# EAGLE design OPLSniffer (EAGLE 6.4)
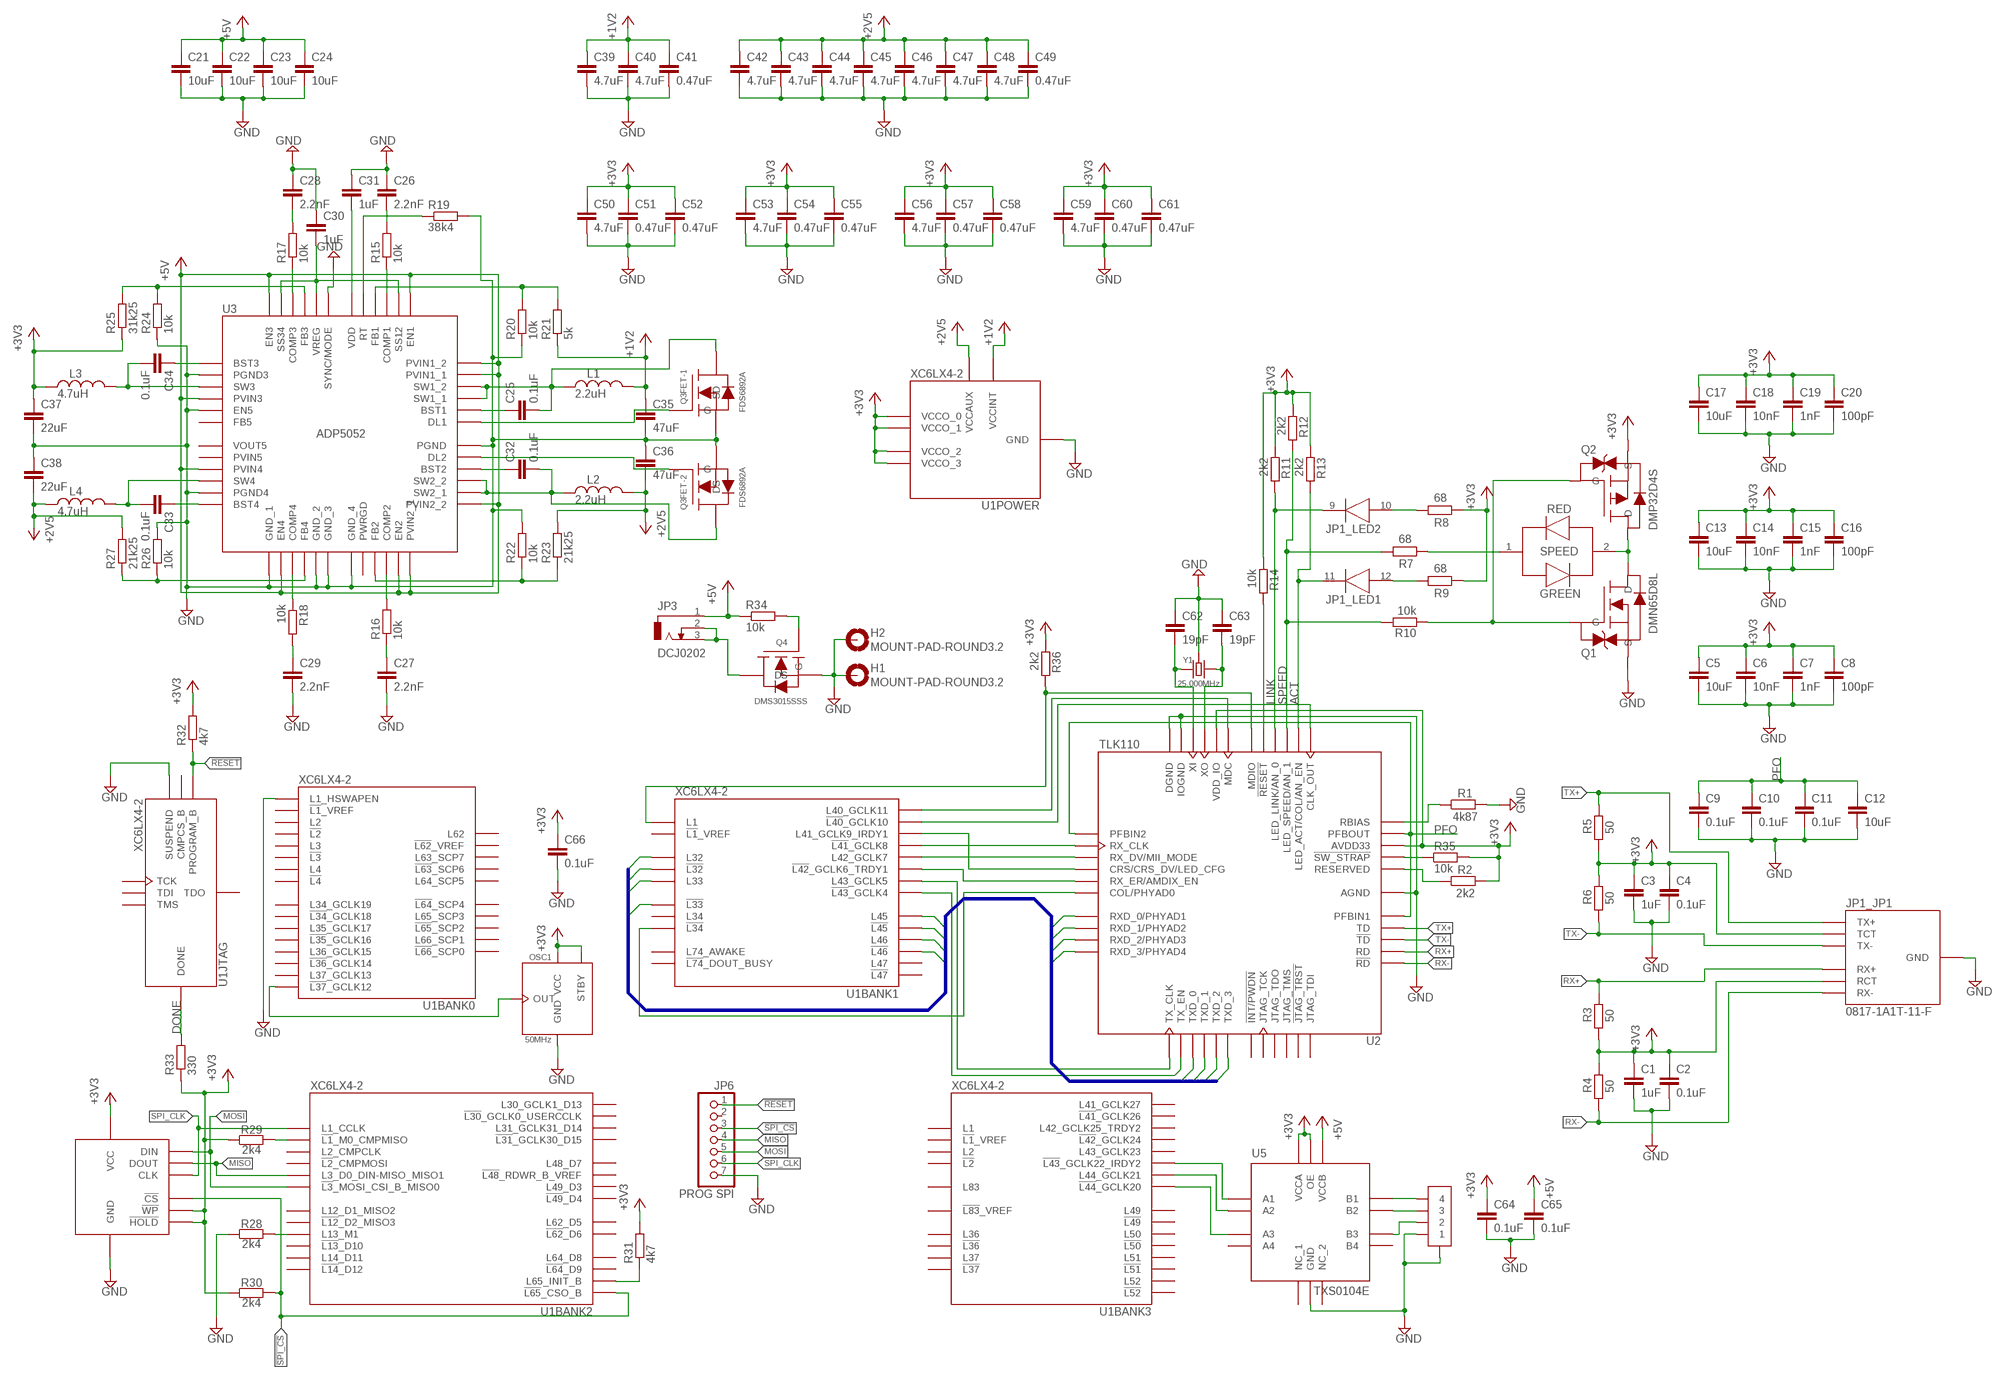
[diagram p0: schematic, sheet 1]

## Parts
C1  1uF  C-EUC0603K  [C0603K]
C2  0.1uF  C-EUC0603K  [C0603K]
C3  1uF  C-EUC0603K  [C0603K]
C4  0.1uF  C-EUC0603K  [C0603K]
C5  10uF  C-EUC0805K  [C0805K]
C6  10nF  C-EUC0603K  [C0603K]
C7  1nF  C-EUC0603K  [C0603K]
C8  100pF  C-EUC0603K  [C0603K]
C9  0.1uF  C-EUC0603K  [C0603K]
C10  0.1uF  C-EUC0603K  [C0603K]
C11  0.1uF  C-EUC0603K  [C0603K]
C12  10uF  C-EUC0805K  [C0805K]
C13  10uF  C-EUC0805K  [C0805K]
C14  10nF  C-EUC0603K  [C0603K]
C15  1nF  C-EUC0603K  [C0603K]
C16  100pF  C-EUC0603K  [C0603K]
C17  10uF  C-EUC0805K  [C0805K]
C18  10nF  C-EUC0603K  [C0603K]
C19  1nF  C-EUC0603K  [C0603K]
C20  100pF  C-EUC0603K  [C0603K]
C21  10uF  C-EUC0805K  [C0805K]
C22  10uF  C-EUC0805K  [C0805K]
C23  10uF  C-EUC0805K  [C0805K]
C24  10uF  C-EUC0805K  [C0805K]
C25  0.1uF  C-EUC0603K  [C0603K]
C26  2.2nF  C-EUC0603K  [C0603K]
C27  2.2nF  C-EUC0603K  [C0603K]
C28  2.2nF  C-EUC0603K  [C0603K]
C29  2.2nF  C-EUC0603K  [C0603K]
C30  1uF  C-EUC0603K  [C0603K]
C31  1uF  C-EUC0603K  [C0603K]
C32  0.1uF  C-EUC0603K  [C0603K]
C33  0.1uF  C-EUC0603K  [C0603K]
C34  0.1uF  C-EUC0603K  [C0603K]
C35  47uF  C-EUC1206K  [C1206K]
C36  47uF  C-EUC1206K  [C1206K]
C37  22uF  C-EUC0805K  [C0805K]
C38  22uF  C-EUC0805K  [C0805K]
C39  4.7uF  C-EUC0603K  [C0603K]
C40  4.7uF  C-EUC0603K  [C0603K]
C41  0.47uF  C-EUC0603K  [C0603K]
C42  4.7uF  C-EUC0603K  [C0603K]
C43  4.7uF  C-EUC0603K  [C0603K]
C44  4.7uF  C-EUC0603K  [C0603K]
C45  4.7uF  C-EUC0603K  [C0603K]
C46  4.7uF  C-EUC0603K  [C0603K]
C47  4.7uF  C-EUC0603K  [C0603K]
C48  4.7uF  C-EUC0603K  [C0603K]
C49  0.47uF  C-EUC0603K  [C0603K]
C50  4.7uF  C-EUC0603K  [C0603K]
C51  0.47uF  C-EUC0603K  [C0603K]
C52  0.47uF  C-EUC0603K  [C0603K]
C53  4.7uF  C-EUC0603K  [C0603K]
C54  0.47uF  C-EUC0603K  [C0603K]
C55  0.47uF  C-EUC0603K  [C0603K]
C56  4.7uF  C-EUC0603K  [C0603K]
C57  0.47uF  C-EUC0603K  [C0603K]
C58  0.47uF  C-EUC0603K  [C0603K]
C59  4.7uF  C-EUC0603K  [C0603K]
C60  0.47uF  C-EUC0603K  [C0603K]
C61  0.47uF  C-EUC0603K  [C0603K]
C62  19pF  C-EUC0603K  [C0603K]
C63  19pF  C-EUC0603K  [C0603K]
C64  0.1uF  C-EUC0603K  [C0603K]
C65  0.1uF  C-EUC0603K  [C0603K]
C66  0.1uF  C-EUC0603K  [C0603K]
H1  MOUNT-PAD-ROUND3.2  [3,2-PAD]
H2  MOUNT-PAD-ROUND3.2  [3,2-PAD]
JP1  0817-1A1T-11-F  [0817-1A1T-11-F]
JP3  DCJ0202  [DCJ0202]
JP4  OPL2  4PIN_PICOBLADE53261-047153261-0471  [53261-0471_PICOBLADE]
JP6  PROG SPI  PINHEAD_1X7  [PINHEAD_1X7]
L1  2.2uH  INDUCTOR  [NRS4018]
L2  2.2uH  INDUCTOR  [NRS4018]
L3  4.7uH  INDUCTOR  [NRS4018]
L4  4.7uH  INDUCTOR  [NRS4018]
OSC1  50MHz  OSC3225  [SMD3225]
Q1  DMN65D8L  [SOT23]
Q2  DMP32D4S  [SOT23]
Q3  FDS6892A  [SOIC8]
Q4  DMS3015SSS  [SOIC8]
R1  4k87  R-EU_R0603  [R0603]
R2  2k2  R-EU_R0603  [R0603]
R3  50  R-EU_R0603  [R0603]
R4  50  R-EU_R0603  [R0603]
R5  50  R-EU_R0603  [R0603]
R6  50  R-EU_R0603  [R0603]
R7  68  R-EU_R0603  [R0603]
R8  68  R-EU_R0603  [R0603]
R9  68  R-EU_R0603  [R0603]
R10  10k  R-EU_R0603  [R0603]
R11  2k2  R-EU_R0603  [R0603]
R12  2k2  R-EU_R0603  [R0603]
R13  2k2  R-EU_R0603  [R0603]
R14  10k  R-EU_R0603  [R0603]
R15  10k  R-EU_R0603  [R0603]
R16  10k  R-EU_R0603  [R0603]
R17  10k  R-EU_R0603  [R0603]
R18  10k  R-EU_R0603  [R0603]
R19  38k4  R-EU_R0603  [R0603]
R20  10k  R-EU_R0603  [R0603]
R21  5k  R-EU_R0603  [R0603]
R22  10k  R-EU_R0603  [R0603]
R23  21k25  R-EU_R0603  [R0603]
R24  10k  R-EU_R0603  [R0603]
R25  31k25  R-EU_R0603  [R0603]
R26  10k  R-EU_R0603  [R0603]
R27  21k25  R-EU_R0603  [R0603]
R28  2k4  R-EU_R0603  [R0603]
R29  2k4  R-EU_R0603  [R0603]
R30  2k4  R-EU_R0603  [R0603]
R31  4k7  R-EU_R0603  [R0603]
R32  4k7  R-EU_R0603  [R0603]
R33  330  R-EU_R0603  [R0603]
R34  10k  R-EU_R0603  [R0603]
R35  10k  R-EU_R0603  [R0603]
R36  2k2  R-EU_R0603  [R0603]
SPEED  RG-LED  [CHIPLED_0805]
U1  XC6LX4-2  [TQFP144]
U2  TLK110  [LQFP48]
U3  ADP5052  [LFSCP48]
U4  M25P16-VMN6P  [SOIC8]
U5  TXS0104E  [TSSOP14]
Y1  25.000MHz  CRYSTAL_GND3225  [SMD3225]

## Nets
!RESET: JP6.1 R32.1 U1.37(JTAG:PROGRAM_B)
!SPI_CS: JP6.3 R30.2 U1.38(BANK2:!L65!_CSO_B) U4.1(!CS)
+1V2: C35.1 C39.1 C40.1 C41.1 L1.2 R21.1 U1.19(POWER:VCCINT) U1.28(POWER:VCCINT) U1.52(POWER:VCCINT) U1.89(POWER:VCCINT) U1.128(POWER:VCCINT)
+2V5: C36.2 C38.2 C42.1 C43.1 C44.1 C45.1 C46.1 C47.1 C48.1 C49.1 L2.2 L4.1 R23.2 R27.2 U1.20(POWER:VCCAUX) U1.36(POWER:VCCAUX) U1.53(POWER:VCCAUX) U1.90(POWER:VCCAUX) U1.129(POWER:VCCAUX)
+3V3: C1.1 C2.1 C3.1 C4.1 C5.1 C6.1 C7.1 C8.1 C13.1 C14.1 C15.1 C16.1 C17.1 C18.1 C19.1 C20.1 C37.1 C50.1 C51.1 C52.1 C53.1 C54.1 C55.1 C56.1 C57.1 C58.1 C59.1 C60.1 C61.1 C64.1 C66.1 JP1.3(_JP1:TCT) JP1.6(_JP1:RCT) L3.1 OSC1.1(STBY) OSC1.4(VCC) Q2.2(S) R2.2 R3.1 R4.2 R5.1 R6.2 R8.1 R9.1 R11.1 R12.1 R13.1 R14.1 R25.1 R29.1 R30.1 R31.2 R32.2 R33.1 R35.2 R36.1 U1.4(POWER:VCCO_3) U1.18(POWER:VCCO_3) U1.31(POWER:VCCO_3) U1.42(POWER:VCCO_2) U1.63(POWER:VCCO_2) U1.76(POWER:VCCO_1) U1.86(POWER:VCCO_1) U1.103(POWER:VCCO_1) U1.122(POWER:VCCO_0) U1.125(POWER:VCCO_0) U1.135(POWER:VCCO_0) U2.22(AVDD33) U2.32(VDD_IO) U2.48(VDD_IO) U4.3(!WP) U4.7(!HOLD) U4.8(VCC) U5.1(VCCA) U5.8(OE)
+5V: C21.1 C22.1 C23.1 C24.1 C65.1 JP3.1 R34.1 U3.4(PVIN3) U3.9(PVIN4) U3.14(EN4) U3.23(EN2) U3.24(PVIN2_1) U3.25(PVIN2_2) U3.35(PVIN1_1) U3.36(PVIN1_2) U3.37(EN1) U3.48(EN3) U5.14(VCCB)
ACT: JP1.11(_LED1:C) R13.2 U2.26(LED_ACT/COL/AN_EN)
DONE: R33.2 U1.71(JTAG:DONE)
GND: C1.2 C2.2 C3.2 C4.2 C5.2 C6.2 C7.2 C8.2 C9.2 C10.2 C11.2 C12.2 C13.2 C14.2 C15.2 C16.2 C17.2 C18.2 C19.2 C20.2 C21.2 C22.2 C23.2 C24.2 C26.1 C27.2 C28.1 C29.2 C30.1 C31.1 C35.2 C36.1 C37.2 C38.1 C39.2 C40.2 C41.2 C42.2 C43.2 C44.2 C45.2 C46.2 C47.2 C48.2 C49.2 C50.2 C51.2 C52.2 C53.2 C54.2 C55.2 C56.2 C57.2 C58.2 C59.2 C60.2 C61.2 C62.1 C63.1 C64.2 C65.2 C66.2 H1.B3,2(MOUNT) H2.B3,2(MOUNT) JP1.4(_JP1:GND) JP1.5(_JP1:GND) JP1.GND1(_JP1:GND) JP1.GND2(_JP1:GND) JP4.1 JP4.GND1(GND) JP4.GND2(GND) JP6.7 OSC1.2(GND) Q1.2(S) Q3.1(FET-2:S) Q3.3(FET-1:S) Q4.1(S) Q4.2(S) Q4.3(S) R1.2 R19.2 R20.1 R22.2 R24.1 R26.2 R28.1 U1.3(POWER:GND) U1.13(POWER:GND) U1.25(POWER:GND) U1.49(POWER:GND) U1.54(POWER:GND) U1.68(POWER:GND) U1.73(JTAG:SUSPEND) U1.77(POWER:GND) U1.91(POWER:GND) U1.96(POWER:GND) U1.108(POWER:GND) U1.113(POWER:GND) U1.130(POWER:GND) U1.136(POWER:GND) U1.144(BANK0:L1_HSWAPEN) U2.15(AGND) U2.19(AGND) U2.35(IOGND) U2.36(DGND) U2.47(IOGND) U3.2(PGND3) U3.5(EN5) U3.11(PGND4) U3.13(GND_1) U3.17(GND_2) U3.18(GND_3) U3.19(GND_4) U3.30(PGND) U3.43(SYNC/MODE) U3.PAD(PGND) U4.4(GND) U5.7(GND) Y1.2(GND) Y1.4(GND)
LINK: JP1.9(_LED2:C) R11.2 U2.28(LED_LINK/AN_0)
MISO: JP6.4 U1.65(BANK2:L3_D0_DIN-MISO_MISO1) U4.2(DOUT)
MOSI: JP6.5 U1.64(BANK2:!L3!_MOSI_CSI_B_MISO0) U4.5(DIN)
N$1: R1.1 U2.24(RBIAS)
N$2: R2.1 U2.20(RESERVED)
N$3: JP1.12(_LED1:A) R9.2
N$4: R14.2 U2.29(!RESET)
N$5: JP1.10(_LED2:A) R8.2
N$6: R7.1 SPEED.1
N$7: Q1.3(D) Q2.3(D) SPEED.2
N$8: Q1.1(G) Q2.1(G) R10.1
N$9: U1.85(BANK1:L43_GCLK5) U2.1(TX_CLK)
N$10: C62.2 U2.34(XI) Y1.1
N$11: U1.84(BANK1:!L43!_GCLK4) U2.2(TX_EN)
N$12: U1.87(BANK1:!L42!_GCLK6_TRDY1) U2.41(RX_ER/AMDIX_EN)
N$13: U1.88(BANK1:L42_GCLK7) U2.39(RX_DV/MII_MODE)
N$14: U1.92(BANK1:!L41!_GCLK8) U2.38(RX_CLK)
N$15: U1.94(BANK1:!L40!_GCLK10) U2.25(CLK_OUT)
N$16: U1.95(BANK1:L40_GCLK11) U2.31(MDC)
N$17: R36.2 U1.105(BANK1:L1) U2.30(MDIO)
N$18: OSC1.3(OUT) U1.123(BANK0:!L37!_GCLK12)
N$22: C32.2 L2.1 Q3.7(FET-2:D) Q3.8(FET-2:D) U3.26(SW2_1) U3.27(SW2_2)
N$23: C28.2 R17.2
N$24: R18.1 U3.15(COMP4)
N$25: R16.2 U3.22(COMP2)
N$26: R15.1 U3.39(COMP1)
N$27: R17.1 U3.46(COMP3)
N$28: C26.2 R15.2
N$29: C25.2 L1.1 Q3.5(FET-1:D) Q3.6(FET-1:D) U3.33(SW1_1) U3.34(SW1_2)
N$30: C29.1 R18.2
N$31: C27.1 R16.1
N$32: C30.2 U3.38(SS12) U3.44(VREG) U3.47(SS34)
N$33: C31.2 U3.42(VDD)
N$34: C25.1 U3.32(BST1)
N$35: C32.1 U3.28(BST2)
N$36: R20.2 R21.2 U3.40(FB1)
N$37: C34.1 U3.1(BST3)
N$38: C34.2 L3.2 U3.3(SW3)
N$39: C33.1 U3.12(BST4)
N$40: C33.2 L4.2 U3.10(SW4)
N$41: R19.1 U3.41(RT)
N$42: JP3.2 JP3.3 Q4.5(D) Q4.6(D) Q4.7(D) Q4.8(D)
N$43: R28.2 U1.60(BANK2:L13_M1)
N$45: Q3.2(FET-2:G) U3.29(DL2)
N$46: Q3.4(FET-1:G) U3.31(DL1)
N$47: R22.1 R23.1 U3.21(FB2)
N$48: R24.2 R25.2 U3.45(FB3)
N$49: R26.1 R27.1 U3.16(FB4)
N$51: R29.2 U1.69(BANK2:!L1!_M0_CMPMISO)
N$52: R31.1 U1.39(BANK2:L65_INIT_B)
N$56: C63.2 U2.33(XO) Y1.3
N$57: Q4.4(G) R34.2
N$60: JP4.2 U5.11(B3)
N$61: JP4.3 U5.12(B2)
N$62: JP4.4 U5.13(B1)
N$63: U1.16(BANK3:!L43!_GCLK22_IRDY2) U5.2(A1)
N$64: U1.15(BANK3:L44_GCLK21) U5.3(A2)
N$65: U1.14(BANK3:!L44!_GCLK20) U5.4(A3)
N$68: U1.93(BANK1:L41_GCLK9_IRDY1) U2.40(CRS/CRS_DV/LED_CFG)
N$70: U1.97(BANK1:!L34) U2.42(COL/PHYAD0)
N$71: R35.1 U2.21(!SW_STRAP)
PFO: C9.1 C10.1 C11.1 C12.1 U2.18(PFBIN1) U2.23(PFBOUT) U2.37(PFBIN2)
RX+: JP1.7(_JP1:RX+) R3.2 U2.14(RD)
RX-: JP1.8(_JP1:RX-) R4.1 U2.13(!RD)
RXD0: U1.102(BANK1:L32) U2.43(RXD_0/PHYAD1)
RXD1: U1.101(BANK1:!L32) U2.44(RXD_1/PHYAD2)
RXD2: U1.100(BANK1:L33) U2.45(RXD_2/PHYAD3)
RXD3: U1.99(BANK1:!L33) U2.46(RXD_3/PHYAD4)
SPEED: R7.2 R10.2 R12.2 U2.27(LED_SPEED/AN_1)
SPI_CLK: JP6.6 U1.70(BANK2:L1_CCLK) U4.6(CLK)
TX+: JP1.1(_JP1:TX+) R5.2 U2.17(TD)
TX-: JP1.2(_JP1:TX-) R6.1 U2.16(!TD)
TXD0: U1.83(BANK1:L45) U2.3(TXD_0)
TXD1: U1.82(BANK1:!L45) U2.4(TXD_1)
TXD2: U1.81(BANK1:L46) U2.5(TXD_2)
TXD3: U1.80(BANK1:!L46) U2.6(TXD_3)
Unconnected: JP6.2 U1.1(BANK3:!L83!_VREF) U1.2(BANK3:L83) U1.5(BANK3:!L52) U1.6(BANK3:L52) U1.7(BANK3:!L51) U1.8(BANK3:L51) U1.9(BANK3:!L50) U1.10(BANK3:L50) U1.11(BANK3:!L49) U1.12(BANK3:L49) U1.17(BANK3:L43_GCLK23) U1.21(BANK3:!L42!_GCLK24) U1.22(BANK3:L42_GCLK25_TRDY2) U1.23(BANK3:!L41!_GCLK26) U1.24(BANK3:L41_GCLK27) U1.26(BANK3:!L37) U1.27(BANK3:L37) U1.29(BANK3:!L36) U1.30(BANK3:L36) U1.32(BANK3:!L2) U1.33(BANK3:L2) U1.34(BANK3:!L1!_VREF) U1.35(BANK3:L1) U1.40(BANK2:!L64!_D9) U1.41(BANK2:L64_D8) U1.43(BANK2:!L62!_D6) U1.44(BANK2:L62_D5) U1.45(BANK2:!L49!_D4) U1.46(BANK2:L49_D3) U1.47(BANK2:!L48!_RDWR_B_VREF) U1.48(BANK2:L48_D7) U1.50(BANK2:!L31!_GCLK30_D15) U1.51(BANK2:L31_GCLK31_D14) U1.55(BANK2:!L30!_GCLK0_USERCCLK) U1.56(BANK2:L30_GCLK1_D13) U1.57(BANK2:!L14!_D12) U1.58(BANK2:L14_D11) U1.59(BANK2:!L13!_D10) U1.61(BANK2:!L12!_D2_MISO3) U1.62(BANK2:L12_D1_MISO2) U1.66(BANK2:!L2!_CMPMOSI) U1.67(BANK2:L2_CMPCLK) U1.72(JTAG:CMPCS_B) U1.74(BANK1:!L74!_DOUT_BUSY) U1.75(BANK1:L74_AWAKE) U1.78(BANK1:!L47) U1.79(BANK1:L47) U1.98(BANK1:L34) U1.104(BANK1:!L1!_VREF) U1.106(JTAG:TDO) U1.107(JTAG:TMS) U1.109(JTAG:TCK) U1.110(JTAG:TDI) U1.111(BANK0:!L66!_SCP0) U1.112(BANK0:L66_SCP1) U1.114(BANK0:!L65!_SCP2) U1.115(BANK0:L65_SCP3) U1.116(BANK0:!L64!_SCP4) U1.117(BANK0:L64_SCP5) U1.118(BANK0:!L63!_SCP6) U1.119(BANK0:L63_SCP7) U1.120(BANK0:!L62!_VREF) U1.121(BANK0:L62) U1.124(BANK0:L37_GCLK13) U1.126(BANK0:!L36!_GCLK14) U1.127(BANK0:L36_GCLK15) U1.131(BANK0:!L35!_GCLK16) U1.132(BANK0:L35_GCLK17) U1.133(BANK0:!L34!_GCLK18) U1.134(BANK0:L34_GCLK19) U1.137(BANK0:!L4) U1.138(BANK0:L4) U1.139(BANK0:!L3) U1.140(BANK0:L3) U1.141(BANK0:!L2) U1.142(BANK0:L2) U1.143(BANK0:!L1!_VREF) U2.7(!INT/PWDN) U2.8(JTAG_TCK) U2.9(JTAG_TDO) U2.10(JTAG_TMS) U2.11(!JTAG_TRST) U2.12(JTAG_TDI) U3.6(FB5) U3.20(PWRGD) U5.5(A4) U5.6(NC_1) U5.9(NC_2) U5.10(B4)

## Buses
RXD[0..3],TXD[0..3]

## Power pins joined to a net without a drawn wire
PVIN5: U3.8(PVIN5)
VOUT5: U3.7(VOUT5)

## Library data of the parts
C1 C3 C30 C31 = rcl:C-EU: CAPACITOR, European symbol; MPN: MC0603X105M6R3CT; OC_FARNELL: 2309013
C2 C4 C9-C11 = rcl:C-EU: CAPACITOR, European symbol; MPN: MC0603B104J250CT; OC_FARNELL: 2310559
C5 C12 C13 C17 C22-C24 = rcl:C-EU: CAPACITOR, European symbol; MPN: MC0805X106K250CT; OC_FARNELL: 2366835
C6 C14 C18 = rcl:C-EU: CAPACITOR, European symbol; MPN: MCCA000238; OC_FARNELL: 1759104
C7 C15 C19 = rcl:C-EU: CAPACITOR, European symbol; MPN: MC0603B102K500CT; OC_FARNELL: 1759088
C8 C16 C20 = rcl:C-EU: CAPACITOR, European symbol; MPN: MCCA001175; OC_FARNELL: 1856366
C21 = rcl:C-EU: CAPACITOR, European symbol; MPN: GRM21BR61E106KA73L; OC_FARNELL: 2366835
C25 C32-C34 C64-C66 = rcl:C-EU: CAPACITOR, European symbol; MPN: MC0603B104J250CT; OC_FARNELL: 2320793
C26-C29 = rcl:C-EU: CAPACITOR, European symbol; MPN: MCCA001160; OC_FARNELL: 18563498
C35 C36 = rcl:C-EU: CAPACITOR, European symbol; MPN: GRM31CR60J476KE19L; OC_FARNELL: 1828809
C37 C38 = rcl:C-EU: CAPACITOR, European symbol; MPN: C0805C226M9PACTU; OC_FARNELL: 1108326
C39 C40 C42-C48 C50 C53 C56 C59 = rcl:C-EU: CAPACITOR, European symbol; MPN: MC0603X475K6R3CT; OC_FARNELL: 2320811
C41 C49 C51 C52 C54 C55 C57 C58 C60 C61 = rcl:C-EU: CAPACITOR, European symbol; MPN: MC0603X474K100CT; OC_FARNELL: 1759396
C62 C63 = rcl:C-EU: CAPACITOR, European symbol; MFR: Kemet; MPN: C0603C180J5GACTU; OC_FARNELL: 1414620; URL: https://uk.farnell.com/kemet/c0603c180j5gactu/cap-18pf-50v-5-c0g-np0-0603/dp/1414620
H1 H2 = holes:MOUNT-PAD-ROUND: MOUNTING PAD, round
JP1 = OPLLib:0817-1A1T-11-F; MPN: 0817-1A1T-11-F; OC_DIGIKEY: 507-1423-ND
JP3 = con-jack:DCJ0202: DC POWER JACK Source: DCJ0202.pdf; OC_FARNELL: unknown; OC_NEWARK: unknown
JP4 = OPLLib:4PIN_PICOBLADE; MFR: Molex; MPN: 53261-0471; OC_FARNELL: 1125374; RECEPTICAL: https://uk.farnell.com/molex/51021-0400/connector-housing-rcpt-4pos/dp/9733116; URL: https://uk.farnell.com/molex/53261-0471/connector-header-4pos-1row-1-25mm/dp/1125374
JP6 = OPLLib:PINHEAD_1X7
L1 L2 = OPLLib:INDUCTOR; MPN: NRS4018T2R2MDGJ; OC_DIGIKEY: 587-2893-1-ND; OC_FARNELL: 1904372
L3 L4 = OPLLib:INDUCTOR; MPN: NRS4018T4R7MDGJ; OC_DIGIKEY: 587-2890-1-ND; OC_FARNELL: 1904376
OSC1 = OPLLib:OSC; MFR: Abracon; MPN: ASE-50.000MHZ-L-R-T; OC_FARNELL: 2849491; URL: https://uk.farnell.com/abracon/ase-50-000mhz-l-r-t/osc-50mhz-3-2mm-x-2-5mm-cmos/dp/2849491
Q1 = OPLLib:DMN65D8L; MPN: DMN65D8L; OC_DIGIKEY: DMN65D8L-7DICT-ND
Q2 = OPLLib:DMP32D4S; MPN: DMP32D4S-13; OC_DIGIKEY: DMP32D4S-13DICT-ND
Q3 = OPLLib:FDS6892A; MPN: FDS6892A; OC_FARNELL: 1653651
Q4 = OPLLib:DMS3015SSS
R1 = rcl:R-EU_: RESISTOR, European symbol; MPN: CRCW06034K87FKEA; OC_FARNELL: 1692529
R2 R11-R13 R36 = rcl:R-EU_: RESISTOR, European symbol; MPN: MCMR06X2201FTL; OC_FARNELL: 2073429
R3-R6 = rcl:R-EU_: RESISTOR, European symbol; MPN: CRCW060350R0FKEA; OC_FARNELL: 2112878
R7-R9 = rcl:R-EU_: RESISTOR, European symbol; MPN: MCMR06X68R0FTL; OC_FARNELL: 2073564
R10 R14-R18 R20 R22 R24 R26 R34 R35 = rcl:R-EU_: RESISTOR, European symbol; MPN: MC0063W0603110K; OC_FARNELL: 2130939
R19 = rcl:R-EU_: RESISTOR, European symbol; MPN: CRCW060338K3FKEA; OC_FARNELL: 2138462
R21 = rcl:R-EU_: RESISTOR, European symbol; MPN: MC0063W060314K99; OC_FARNELL: 2130914
R23 R27 = rcl:R-EU_: RESISTOR, European symbol; MPN: MC0063W0603121K5; OC_FARNELL: 1170919
R25 = rcl:R-EU_: RESISTOR, European symbol; MPN: CRCW060331K6FKEA; OC_FARNELL: 2138454
R28-R30 = rcl:R-EU_: RESISTOR, European symbol; MPN: MCMR06X2401FTL; OC_FARNELL: 2073445
R31 R32 = rcl:R-EU_: RESISTOR, European symbol; MPN: MCMR06X4701FTL; OC_FARNELL: 2073509
R33 = rcl:R-EU_: RESISTOR, European symbol; MPN: MCMR06X3300FTL; OC_FARNELL: 2073472
SPEED = OPLLib:RG-LED; MPN: KPB-2012SURKCGKC; OC_FARNELL: 2079908
U1 = OPLLib:XC6LX4-2; MPN: XC6SLX4-2TQG144C; OC_FARNELL: 1876221
U2 = OPLLib:TLK110; MPN: TLK110PTR; OC_FARNELL: 2335631
U3 = OPLLib:ADP5052; MPN: ADP5052ACPZ-R7; OC_FARNELL: 2334520
U4 = OPLLib:M25P16; MPN: M25P16-VMN6P; OC_FARNELL: 1734973
U5 = OPLLib:TXS0104E
Y1 = OPLLib:CRYSTAL_GND; MFR: Multicomp; MPN: MCSJK-7U-25.00-12-10-60-B-10; OC_FARNELL: 2853968; URL: https://uk.farnell.com/multicomp/mcsjk-7u-25-00-12-10-60-b-10/crystal-25mhz-12pf-3-2mm-x-2-5mm/dp/2853968

## Board
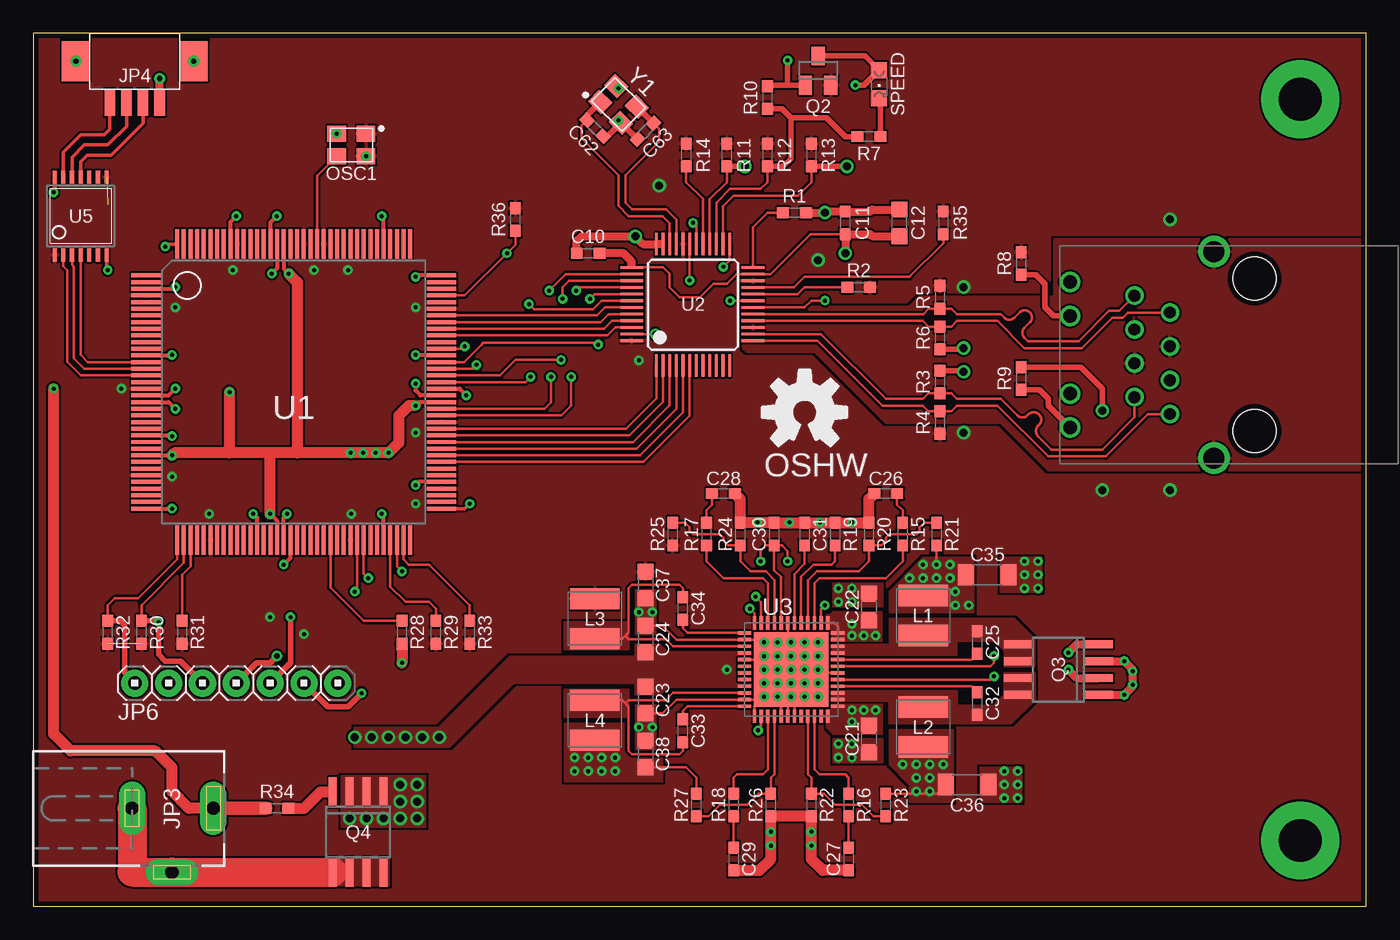
[diagram p1: board, top side]
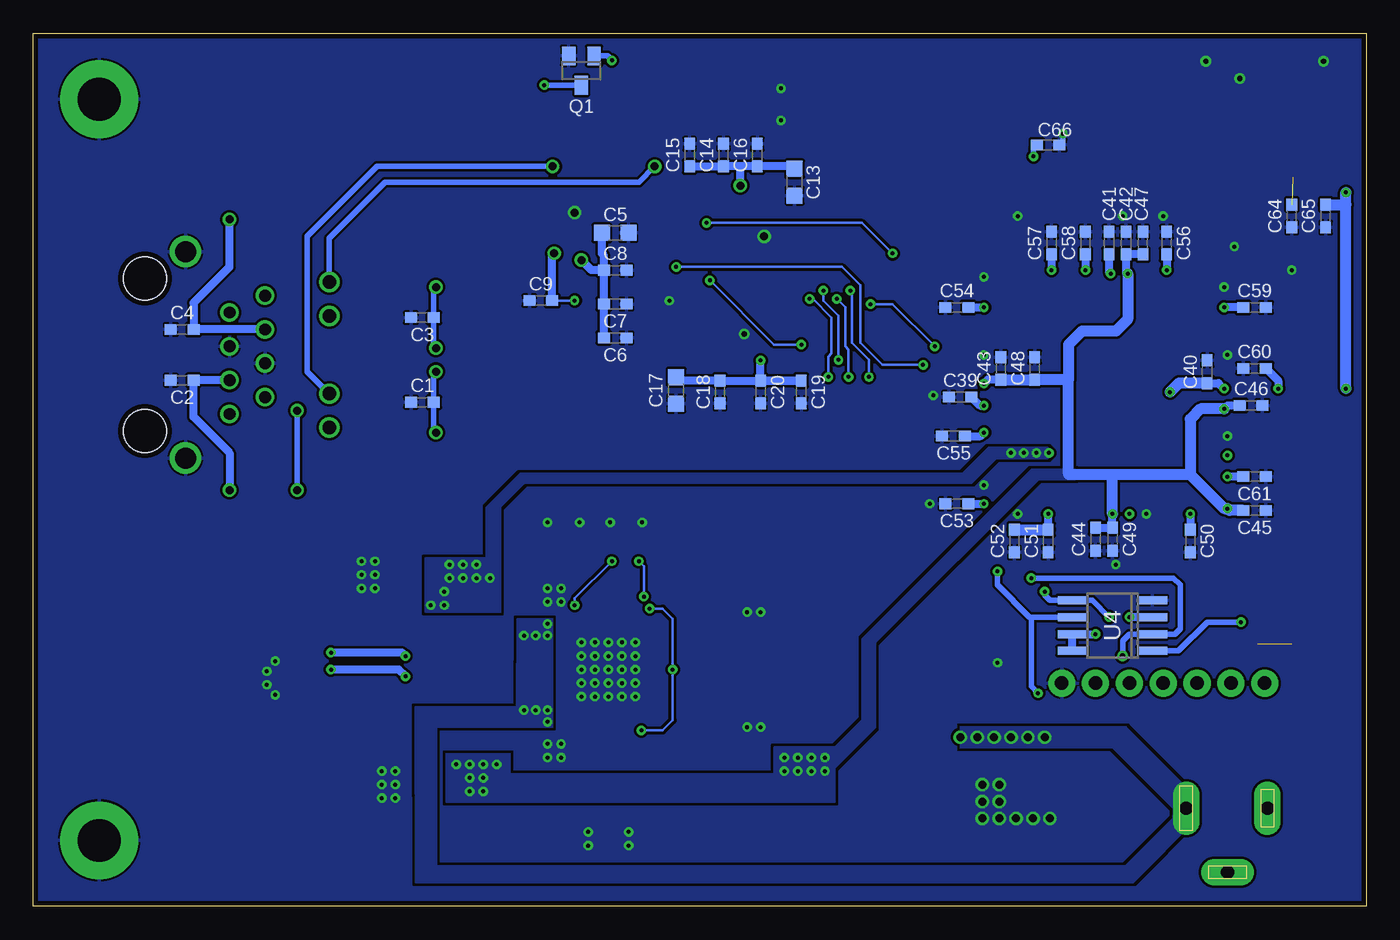
[diagram p2: board, bottom side, seen from below]

Size 100.08 x 65.53 mm. Coordinates in mm from the lower left corner, seen from the top.
Outline: 0,0 100.08,0 100.08,65.53 0,65.53 0,0
Copper layers (1*16): Top 0.035mm / dielectric 1.5mm / Bottom 0.035mm
Design rules "OSH Park *": minimum track width 6mil, minimum drill 10mil, track to track 6mil, track to pad 6mil, pad to pad 6mil, via to via 6mil, smd to smd 6mil, copper to edge 15mil, drill to drill 8mil, minimum pad ring 10mil, minimum via ring 8mil, stop-mask expansion 4mil, vias tented up to drill 264208mil, thermal gap 6mil

### Footprints (pad centres in the part's own frame; a part is rotated, then mirrored left to right if it is on the bottom)
C0603K = smd 0.9 x 0.8: 1 -0.85,0; 2 0.85,0
C0805K = smd 1.2 x 1.2: 1 -1,0; 2 1,0
C1206K = smd 1.2 x 1.6: 1 -1.6,0; 2 1.6,0
3,2-PAD = drill 3.2 pad 5.842: B3,2 0,0
0817-1A1T-11-F = drill 0.889: 1 4.445,2.667; 2 3.175,0; 3 1.905,2.667; 4 0.635,0; 5 -0.635,2.667; 6 -1.905,0; 7 -3.175,2.667; 8 -4.445,0 | drill 1.016: 9 5.461,7.493; 10 2.921,7.493; 11 -2.921,7.493; 12 -5.461,7.493 | drill 1.575: GND1 -7.747,-3.302; GND2 7.747,-3.302 | hole 3.251: -5.715,-6.35; 5.715,-6.35
DCJ0202 = drill 1 pad 2 long: 1 0,3.1; 2 4.8,0; 3 0,-3
53261-0471_PICOBLADE = smd 0.8 x 2: 1 -1.875,1; 2 -0.625,1; 3 0.625,1; 4 1.875,1 | smd 2.1 x 3: GND1 -4.425,-2.1; GND2 4.425,-2.1
PINHEAD_1X7 = drill 1.016 pad 2.032: 1 -7.62,0; 2 -5.08,0; 3 -2.54,0; 4 0,0; 5 2.54,0; 6 5.08,0; 7 7.62,0
NRS4018 = smd 1.6 x 3.7: 1 -1.5,0; 2 1.5,0
SMD3225 = smd 1.4 x 1.2: 1 -1.1,-0.85; 2 1.1,-0.85; 3 1.1,0.85; 4 -1.1,0.85
SOT23 = smd 1 x 1.4: 1 -0.95,-1.1; 2 0.95,-1.1; 3 0,1.1
SOIC8 = smd 0.6 x 2.2: 1 -1.905,-3; 2 -0.635,-3; 3 0.635,-3; 4 1.905,-3; 5 1.905,3; 6 0.635,3; 7 -0.635,3; 8 -1.905,3
R0603 = smd 0.9 x 0.8: 1 -0.85,0; 2 0.85,0
CHIPLED_0805 = smd 1.2 x 1.2: 1 0,1.05; 2 0,-1.05
TQFP144 = smd 0.3 x 2.2: 1 -8.75,-11.1; 2 -8.25,-11.1; 3 -7.75,-11.1; 4 -7.25,-11.1; 5 -6.75,-11.1; 6 -6.25,-11.1; 7 -5.75,-11.1; 8 -5.25,-11.1; 9 -4.75,-11.1; 10 -4.25,-11.1; 11 -3.75,-11.1; 12 -3.25,-11.1; 13 -2.75,-11.1; 14 -2.25,-11.1; 15 -1.75,-11.1; 16 -1.25,-11.1; 17 -0.75,-11.1; 18 -0.25,-11.1; 19 0.25,-11.1; 20 0.75,-11.1; 21 1.25,-11.1; 22 1.75,-11.1; 23 2.25,-11.1; 24 2.75,-11.1; 25 3.25,-11.1; 26 3.75,-11.1; 27 4.25,-11.1; 28 4.75,-11.1; 29 5.25,-11.1; 30 5.75,-11.1; 31 6.25,-11.1; 32 6.75,-11.1; 33 7.25,-11.1; 34 7.75,-11.1; 35 8.25,-11.1; 36 8.75,-11.1; 73 8.75,11.1; 74 8.25,11.1; 75 7.75,11.1; 76 7.25,11.1; 77 6.75,11.1; 78 6.25,11.1; 79 5.75,11.1; 80 5.25,11.1; 81 4.75,11.1; 82 4.25,11.1; 83 3.75,11.1; 84 3.25,11.1; 85 2.75,11.1; 86 2.25,11.1; 87 1.75,11.1; 88 1.25,11.1; 89 0.75,11.1; 90 0.25,11.1; 91 -0.25,11.1; 92 -0.75,11.1; 93 -1.25,11.1; 94 -1.75,11.1; 95 -2.25,11.1; 96 -2.75,11.1; 97 -3.25,11.1; 98 -3.75,11.1; 99 -4.25,11.1; 100 -4.75,11.1; 101 -5.25,11.1; 102 -5.75,11.1; 103 -6.25,11.1; 104 -6.75,11.1; 105 -7.25,11.1; 106 -7.75,11.1; 107 -8.25,11.1; 108 -8.75,11.1 | smd 2.2 x 0.3: 37 11.1,-8.75; 38 11.1,-8.25; 39 11.1,-7.75; 40 11.1,-7.25; 41 11.1,-6.75; 42 11.1,-6.25; 43 11.1,-5.75; 44 11.1,-5.25; 45 11.1,-4.75; 46 11.1,-4.25; 47 11.1,-3.75; 48 11.1,-3.25; 49 11.1,-2.75; 50 11.1,-2.25; 51 11.1,-1.75; 52 11.1,-1.25; 53 11.1,-0.75; 54 11.1,-0.25; 55 11.1,0.25; 56 11.1,0.75; 57 11.1,1.25; 58 11.1,1.75; 59 11.1,2.25; 60 11.1,2.75; 61 11.1,3.25; 62 11.1,3.75; 63 11.1,4.25; 64 11.1,4.75; 65 11.1,5.25; 66 11.1,5.75; 67 11.1,6.25; 68 11.1,6.75; 69 11.1,7.25; 70 11.1,7.75; 71 11.1,8.25; 72 11.1,8.75; 109 -11.1,8.75; 110 -11.1,8.25; 111 -11.1,7.75; 112 -11.1,7.25; 113 -11.1,6.75; 114 -11.1,6.25; 115 -11.1,5.75; 116 -11.1,5.25; 117 -11.1,4.75; 118 -11.1,4.25; 119 -11.1,3.75; 120 -11.1,3.25; 121 -11.1,2.75; 122 -11.1,2.25; 123 -11.1,1.75; 124 -11.1,1.25; 125 -11.1,0.75; 126 -11.1,0.25; 127 -11.1,-0.25; 128 -11.1,-0.75; 129 -11.1,-1.25; 130 -11.1,-1.75; 131 -11.1,-2.25; 132 -11.1,-2.75; 133 -11.1,-3.25; 134 -11.1,-3.75; 135 -11.1,-4.25; 136 -11.1,-4.75; 137 -11.1,-5.25; 138 -11.1,-5.75; 139 -11.1,-6.25; 140 -11.1,-6.75; 141 -11.1,-7.25; 142 -11.1,-7.75; 143 -11.1,-8.25; 144 -11.1,-8.75
LQFP48 = smd 0.2 x 1.7: 1 -2.75,-4.6; 2 -2.25,-4.6; 3 -1.75,-4.6; 4 -1.25,-4.6; 5 -0.75,-4.6; 6 -0.25,-4.6; 7 0.25,-4.6; 8 0.75,-4.6; 9 1.25,-4.6; 10 1.75,-4.6; 11 2.25,-4.6; 12 2.75,-4.6; 25 2.75,4.5; 26 2.25,4.5; 27 1.75,4.5; 28 1.25,4.5; 29 0.75,4.5; 30 0.25,4.5; 31 -0.25,4.5; 32 -0.75,4.5; 33 -1.25,4.5; 34 -1.75,4.5; 35 -2.25,4.5; 36 -2.75,4.5 | smd 1.7 x 0.2: 13 4.5,-2.75; 14 4.5,-2.25; 15 4.5,-1.75; 16 4.5,-1.25; 17 4.5,-0.75; 18 4.5,-0.25; 19 4.5,0.25; 20 4.5,0.75; 21 4.5,1.25; 22 4.5,1.75; 23 4.5,2.25; 24 4.5,2.75; 37 -4.6,2.75; 38 -4.6,2.25; 39 -4.6,1.75; 40 -4.6,1.25; 41 -4.6,0.75; 42 -4.6,0.25; 43 -4.6,-0.25; 44 -4.6,-0.75; 45 -4.6,-1.25; 46 -4.6,-1.75; 47 -4.6,-2.25; 48 -4.6,-2.75
LFSCP48 = smd 1 x 0.25: 1 -3.5,2.75; 2 -3.5,2.25; 3 -3.5,1.75; 4 -3.5,1.25; 5 -3.5,0.75; 6 -3.5,0.25; 7 -3.5,-0.25; 8 -3.5,-0.75; 9 -3.5,-1.25; 10 -3.5,-1.75; 11 -3.5,-2.25; 12 -3.5,-2.75; 25 3.5,-2.75; 26 3.5,-2.25; 27 3.5,-1.75; 28 3.5,-1.25; 29 3.5,-0.75; 30 3.5,-0.25; 31 3.5,0.25; 32 3.5,0.75; 33 3.5,1.25; 34 3.5,1.75; 35 3.5,2.25; 36 3.5,2.75 | smd 0.25 x 1: 13 -2.75,-3.5; 14 -2.25,-3.5; 15 -1.75,-3.5; 16 -1.25,-3.5; 17 -0.75,-3.5; 18 -0.25,-3.5; 19 0.25,-3.5; 20 0.75,-3.5; 21 1.25,-3.5; 22 1.75,-3.5; 23 2.25,-3.5; 24 2.75,-3.5; 37 2.75,3.5; 38 2.25,3.5; 39 1.75,3.5; 40 1.25,3.5; 41 0.75,3.5; 42 0.25,3.5; 43 -0.25,3.5; 44 -0.75,3.5; 45 -1.25,3.5; 46 -1.75,3.5; 47 -2.25,3.5; 48 -2.75,3.5 | smd 5.6 x 5.6: PAD 0,0
TSSOP14 = smd 0.305 x 0.991: 1 -1.95,-2.918; 2 -1.3,-2.918; 3 -0.65,-2.918; 4 0,-2.918; 5 0.65,-2.918; 6 1.3,-2.918; 7 1.95,-2.918; 8 1.95,2.918; 9 1.3,2.918; 10 0.65,2.918; 11 0,2.918; 12 -0.65,2.918; 13 -1.3,2.918; 14 -1.95,2.918

### Placement (x,y rotation side)
C1  70.87,37.85 180 bottom
C2  88.9,39.5 180 bottom
C3  70.87,44.2 180 bottom
C4  88.9,43.31 180 bottom
C5  56.39,50.55 0 bottom
C6  56.39,42.67 0 bottom
C7  56.39,45.21 0 bottom
C8  56.39,47.75 0 bottom
C9  61.98,45.47 180 bottom
C10  41.66,49.02 180 top
C11  60.96,51.31 90 top
C12  65.02,51.31 90 top
C13  42.93,54.36 270 bottom
C14  48.26,56.39 90 bottom
C15  50.8,56.39 90 bottom
C16  45.72,56.39 90 bottom
C17  51.82,38.73 270 bottom
C18  48.51,38.61 270 bottom
C19  42.42,38.61 270 bottom
C20  45.47,38.61 270 bottom
C21  62.74,12.57 270 top
C22  62.74,22.48 90 top
C23  45.97,15.49 270 top
C24  45.97,20.07 90 top
C25  70.87,19.81 90 top
C26  64.01,30.99 0 top
C27  61.21,3.56 270 top
C28  51.82,30.99 180 top
C29  52.58,3.56 270 top
C30  55.63,27.94 270 top
C31  57.91,27.94 270 top
C32  70.87,15.24 270 top
C33  48.77,13.19 270 top
C34  48.77,22.37 90 top
C35  71.63,24.89 0 top
C36  70.1,9.14 180 top
C37  45.97,24.13 270 top
C38  45.97,11.43 270 top
C39  30.48,38.23 180 bottom
C40  11.94,40.13 90 bottom
C41  19.3,49.78 90 bottom
C42  18.03,49.78 90 bottom
C43  27.43,40.39 90 bottom
C44  20.32,27.56 270 bottom
C45  8.38,29.72 0 bottom
C46  8.64,37.59 0 bottom
C47  16.76,49.78 90 bottom
C48  24.89,40.39 90 bottom
C49  19.05,27.56 270 bottom
C50  13.21,27.43 270 bottom
C51  23.88,27.43 270 bottom
C52  26.42,27.43 270 bottom
C53  30.73,30.23 180 bottom
C54  30.73,44.96 180 bottom
C55  30.99,35.31 180 bottom
C56  14.99,49.78 90 bottom
C57  23.62,49.78 90 bottom
C58  21.08,49.78 90 bottom
C59  8.38,44.96 0 bottom
C60  8.38,40.39 180 bottom
C61  8.38,32.26 0 bottom
C62  42.16,58.42 135 top
C63  45.97,58.17 45 top
C64  5.59,51.82 270 bottom
C65  3.05,51.82 270 bottom
C66  23.88,57.15 0 bottom
H1  95.12,60.58 0 top
H2  95.12,4.95 0 top
JP1  85.34,41.4 90 top
JP3  10.41,7.37 270 top
JP4  7.62,61.34 180 top
JP6  15.24,16.76 0 top
L1  66.8,21.84 90 top
L2  66.8,13.46 270 top
L3  42.16,21.59 270 top
L4  42.16,13.97 90 top
OSC1  23.88,57.15 180 top
Q1  58.93,62.74 180 bottom
Q2  58.93,62.74 0 top
Q3  76.96,17.78 90 top
Q4  24.38,5.59 180 top
R1  57.15,52.07 0 top
R2  61.98,46.47 0 top
R3  68.07,39.37 270 top
R4  68.07,36.32 270 top
R5  68.07,45.72 270 top
R6  68.07,42.67 270 top
R7  62.74,57.78 180 top
R8  74.17,48.26 270 top
R9  74.17,39.62 270 top
R10  55.12,60.71 270 top
R11  52.07,56.39 270 top
R12  55.12,56.39 270 top
R13  58.42,56.39 270 top
R14  49.02,56.39 270 top
R15  65.28,27.94 90 top
R16  61.21,7.62 90 top
R17  50.55,27.94 90 top
R18  52.58,7.62 270 top
R19  60.2,27.94 90 top
R20  62.74,27.94 270 top
R21  67.82,27.94 90 top
R22  58.42,7.62 270 top
R23  64.01,7.62 90 top
R24  53.09,27.94 270 top
R25  48.01,27.94 90 top
R26  55.37,7.62 270 top
R27  49.78,7.62 90 top
R28  27.69,20.57 90 top
R29  30.23,20.57 90 top
R30  8.13,20.57 90 top
R31  11.18,20.57 270 top
R32  5.59,20.57 270 top
R33  32.77,20.57 90 top
R34  18.29,7.37 0 top
R35  68.33,51.31 90 top
R36  36.2,51.56 270 top
SPEED  63.5,61.72 180 top
U1  19.56,38.61 270 top
U2  49.53,45.21 0 top
U3  56.9,17.78 0 top
U4  19.05,21.08 90 bottom
U5  3.56,51.82 0 top
Y1  43.94,60.2 315 top

### Tracks (layer width: path | path; a pad name or v marks a point on that pad's centre or on a via)
!RESET
  Top 0.203: U1.37 10.81,26.05 7.87,23.11 6.1,23.11 5.59,22.61 R32.1
  Top 0.406: R32.1 6.52,21.42 6.86,21.08 6.86,17.53 JP6.1
!SPI_CS  (via drill 0.3)
  Top 0.203: U1.38 11.31,25.79 8.13,22.61 R30.2
  Top 0.406: R30.2 9.31,21.42 v9.4,21.34 9.4,18.92 9.91,18.41 11.05,18.41 JP6.3
  Bottom 0.406: U4.1 14.1,19.18 11.94,21.34 v9.4,21.34
+1V2  (via drill 0.3)
  Top 0.203: R21.1 67.82,25.91
  Top 0.305: v17.78,29.46 18.31,28.94 U1.52 | U1.19 10.16,38.36 v10.67,38.86 | U1.28 v10.41,33.86 | U1.128 18.81,47.87 v19.18,47.5 | U1.89 28.97,37.86 v28.7,37.59
  Top 0.813: v19.18,47.5 19.81,46.86 19.81,34.04 | v28.7,37.59 28.19,37.59 27.43,36.83 27.43,34.8 v26.67,34.04 v23.81,34.04 19.81,34.04 | 19.81,34.04 17.78,34.04 | 17.78,34.04 14.73,34.04 | 14.73,34.04 v14.73,38.61 | v17.78,29.46 17.78,34.04 | 14.73,34.04 10.59,34.04 v10.41,33.86
  Bottom 0.61: C40.1 11.09,39.28 v10.67,38.86 | C39.1 29,37.59 v28.7,37.59 | C41.1 19.3,47.62 v19.18,47.5
  Bottom 0.813: C40.1 14.06,39.28 v14.73,38.61
  other vias: 65.79,24.64 66.8,24.64 66.8,25.65 67.82,24.64 67.82,25.65 68.83,24.64 68.83,25.65 69.22,23.62 69.22,22.61 70.23,22.61 24.77,34.04 25.72,34.04
  pour Top (no thermals): 64.26,22.1 70.61,22.1 70.61,26.16 66.8,26.16 64.26,23.62
  pour Bottom (no thermals): 65.02,22.1 70.61,22.1 70.61,26.16 66.04,26.16 66.04,29.97 63.5,32.51 30.29,32.51 28.32,34.48 23.94,34.48 23.62,34.16 23.62,33.91 23.94,33.59 27.81,33.59 29.65,31.75 63.25,31.75 65.02,29.97
+2V5  (via drill 0.3)
  Top 0.203: R27.2 49.78,9.65 49.01,10.43 C38.2 | R23.2 67.83,8.47 C36.2
  Top 0.305: U1.20 10.15,37.86 v10.67,37.34 | U1.36 v10.41,29.86 | U1.90 29.08,38.36 28.7,38.73 v28.7,39.24 | U1.129 18.31,47.9 v17.91,47.5 | U1.53 18.81,29.22 v19.05,29.46
  Bottom 0.61: C46.1 10.41,37.59 v10.67,37.34 | C43.1 28.41,39.54 v28.7,39.24 | v17.91,47.5 18.03,47.62 C42.1 C47.1 | C44.1 C49.1 v19.05,29.46
  Bottom 0.813: C43.1 C48.1 22.35,39.54 | 13.21,32.4 13.21,36.58 12.45,37.34 v10.67,37.34 | 13.21,32.4 13.23,32.42 19.05,32.42 | 13.21,32.4 10.67,29.86 v10.41,29.86 10.27,29.72 C45.1 | 22.35,39.54 22.35,32.42 19.05,32.42 | v19.05,29.46 19.05,32.42 | v17.91,47.5 17.91,44.07 18.8,43.18 21.34,43.18 22.35,42.16 22.35,39.54
  other vias: 40.64,11.18 65.28,10.67 41.66,11.18 41.66,10.16 42.67,10.16 42.67,11.18 43.69,11.18 43.69,10.16 66.29,10.67 66.29,9.65 67.31,10.67 68.33,10.67 67.31,9.65 67.31,8.64 66.29,8.64 40.64,10.16
  pour Top (no thermals): 65.79,7.87 69.09,7.87 69.09,13.21 64.26,13.21 64.26,10.67 65.79,9.14
  pour Top (no thermals): 39.88,13.72 39.88,9.4 47.24,9.4 47.24,11.18 44.96,11.18 44.45,11.68 44.45,13.72
  pour Bottom (no thermals): 39.88,11.94 44.45,11.94 44.45,9.91 64.26,9.91 64.26,11.43 69.09,11.43 69.09,7.87 39.88,7.87 39.88,7.87 39.88,10.41 36.83,13.46 36.83,19.81 24.57,32.07 21.84,32.07 21.84,32.77 25.15,32.77 37.85,20.07 37.85,13.97
+3V3  (via drill 0.3, 0.6)  (2 unrouted)
  Top 0.406: R6.2 69.76,41.82 v69.85,41.91 | R3.1 69.76,40.22 v69.85,40.13 | R9.1 78.65,40.47 80.26,38.86 v80.26,37.21
  Bottom 0.406: v80.26,37.21 v80.26,31.24 | v69.85,35.56 70.02,35.73 C1.1 70.02,39.97 v69.85,40.13 | v69.85,46.48 70.02,46.32 C3.1 70.02,42.08 v69.85,41.91 | C66.1 24.98,56.9 OSC1.4
  Bottom 0.61: C6.1 C7.1 C8.1 | C8.1 58.17,47.75 v58.93,48.51 | C15.1 C14.1 46.99,55.54 | JP1.6 C2.1 88.05,36.74 85.34,34.04 v85.34,31.24 | JP1.3 C4.1 88.05,45.3 85.34,48.01 v85.34,51.56 | v13.21,29.46 C50.1 | C51.1 v23.88,29.46 | C53.1 v28.7,30.23 | C54.1 v28.7,44.96 | C56.1 v14.99,47.75 | C58.1 v21.08,47.75 | C57.1 v23.62,47.75 | C61.1 v10.41,32.26 | C59.1 v10.67,44.96 | U4.8 U4.7 v20.32,20.45 | C5.1 57.39,49.01 57.24,48.86 C8.1 | v45.47,40.98 C20.1 C18.1 51.54,39.46 C17.1 | 46.99,55.54 C16.1 43.11,55.54 C13.1 | v46.99,54.1 46.99,55.54 | U4.3 v17.78,21.72 | C55.1 28.96,35.31 v28.7,35.56 | C60.1 6.6,39.46 v6.6,38.86
  Bottom 0.635: C20.1 C19.1
  Bottom 0.813: C52.1 C51.1
  other vias: 24.98,56.3
  pour Top (rank 2): 0,0 100.08,0 100.08,65.53 0,65.53
  pour Top: 39.88,21.84 39.88,24.13 41.91,26.16 47.24,26.16 47.24,24.38 44.96,24.38 44.45,23.88 44.45,21.84
+5V  (via drill 0.3, 0.6)
  Top 0.203: U3.23 U3.24 | U3.14 54.65,13.44 v54.41,13.21 | U3.48 54.15,22.01 v53.81,22.35 | U3.37 60.13,21.28 60.4,21.01 U3.36
  Top 0.305: U5.14 1.61,53.68 v1.52,53.59
  Top 0.813: JP3.1 11.68,7.37 10.41,8.64 10.41,10.41 9.14,11.68 2.79,11.68 1.52,12.95 v1.52,38.86
  Top 1.016: R34.1 JP3.1
  Bottom 0.203: v54.41,13.21 52.83,13.21 52.07,13.97 v52.07,17.78 52.07,21.59 52.83,22.35 v53.81,22.35
  Bottom 0.813: v1.52,38.86 1.52,52.67 | 1.52,52.67 v1.52,53.59 | C65.1 1.52,52.67
  other vias: 63.25,20.32 62.36,20.32 61.47,20.32 61.47,14.73 62.36,14.73 63.25,14.73 61.47,21.21 61.47,13.84 24.13,12.7 25.4,12.7 26.67,12.7 27.94,12.7 29.21,12.7 30.48,12.7
  pour Top (no thermals): 59.56,21.84 59.56,20.83 59.94,20.83 59.97,19.94 63.73,19.94 63.73,22.1 60.07,22.1 59.82,21.84
  pour Top (no thermals): 59.94,15.14 59.94,14.73 59.54,14.73 59.56,13.46 60.05,12.95 63.75,12.95 63.75,15.14
  pour Bottom (no thermals): 61.11,21.59 61.11,13.46 69.85,13.46 69.85,3.05 18.03,3.05 14.48,6.6 14.48,6.86 12.7,6.86 12.7,6.6 17.53,1.78 71.35,1.78 71.37,14.99 63.75,14.99 63.73,21.59
  pour Top (no thermals): 45.21,19.68 47.04,19.68 47.62,19.1 53.85,19.1 53.85,16.46 47.62,16.46 47.04,15.88 45.21,15.88 45.21,16.76 36.07,16.76 31.24,11.94 24.13,11.94 24.13,13.46 30.48,13.46 35.81,18.8 45.21,18.8
  pour Bottom (no thermals): 30.48,13.46 30.48,11.94 19.05,11.94 14.48,7.37 14.48,6.86 12.7,6.86 12.7,8.13 18.03,13.46
ACT  (via drill 0.6)
  Top 0.203: R13.2 58.42,54.36 57.4,53.34 52.58,53.34 51.78,52.54 U2.26
  Top 0.406: v61.09,55.54 R13.2
  Bottom 0.406: JP1.11 79.5,40.13 79.5,50.29 74.26,55.54 v61.09,55.54
DONE
  Top 0.203: U1.71 27.81,26.04 28.19,25.65 29.72,25.65 32.77,22.61 R33.2
GND  (via drill 0.3, 0.4, 0.6)
  Top 0.178: U2.35 47.08,49.71 | v56.9,16.76 56.9,16.83 57.15,17.08
  Top 0.203: U2.19 v52.32,45.46 | U2.47 v46.7,42.96 | C24.2 47.26,21.07 48.3,20.03 U3.2 54.65,20.03 56.15,18.53 | C23.2 47.26,14.49 48.3,15.53 U3.11 54.65,15.53 | 54.65,15.53 56.15,17.03 | U3.30 57.15,17.53 U3.PAD | U3.5 56.15,18.53 | 56.15,18.53 56.65,18.03 | U3.18 56.65,17.53 U3.PAD | 56.7,17.58 U3.PAD | U3.17 56.15,17.03 | U3.13 54.15,15.03 54.65,15.53 | 56.15,17.03 U3.PAD | U3.19 57.15,17.08 | U3.43 56.65,18.03 | 56.65,18.03 U3.PAD
  Top 0.254: U5.7 5.51,47.83 v5.59,47.75 | U1.73 32.4,29.86 v32.77,30.23 | C31.1 59.02,28.79 v59.05,28.83 | U1.144 10.08,49.71 v9.91,49.53
  Top 0.305: U1.25 10.36,35.36 v10.41,35.31 | U1.49 16.81,29.17 v16.51,29.46 | U1.77 28.94,31.86 v28.7,31.62 | U1.108 28.82,47.36 v28.7,47.24 | U1.3 10.54,46.36 v10.67,46.48 | U1.136 14.81,51.38 v15.24,51.82 | U1.113 26.31,51.67 v26.16,51.82 | U1.91 32.01,38.86 v32.51,38.35 | U1.68 26.31,29.32 v26.16,29.46 | U1.13 10.37,41.36 v10.41,41.4 | U1.96 28.75,41.36 v28.7,41.4 | U1.130 17.81,51.34 v18.29,51.82 | v18.8,25.65 19.31,26.17 U1.54
  Top 0.406: Y1.2 C63.1 | C63.1 | Y1.4 v43.94,61.4 | Y1.2 v43.94,59 | C62.1 43.12,57.82 Y1.2
  Top 0.61: R1.2 v59.44,52.07 59.52,52.16 C11.2 62.83,52.16 62.98,52.31 C12.2 | 47.08,49.71 U2.36 45.79,49.71 v45.21,50.29 41.15,50.29 40.81,49.95 C10.2 | Q3.3 v81.92,18.41 82.55,17.78 v82.55,17.65 v82.55,16.64 82.55,16.51 v81.92,15.88 Q3.1 | JP4.1 v9.49,62.13
  Top 0.813: R28.1 v27.69,18.29 | C28.1 53.09,30.57 R24.1 C30.1 C31.1 R19.2 R20.1 62.74,30.57 C26.1 | C29.2 54.52,2.71 55.37,3.56 v55.37,4.57 v55.37,5.59 R26.2 R22.2 v58.42,5.59 v58.42,4.57 58.42,3.56 59.27,2.71 C27.2
  Bottom 0.406: C66.2 22.78,57.4 OSC1.2
  other vias: 56.9,17.78 54.86,17.78 55.88,17.78 57.91,17.78 58.93,17.78 57.91,16.76 58.93,16.76 55.88,16.76 54.86,16.76 54.86,18.8 55.88,18.8 56.9,18.8 57.91,18.8 58.93,18.8 58.93,19.81 57.91,19.81 56.9,19.81 55.88,19.81 54.86,19.81 54.86,15.75 55.88,15.75 56.9,15.75 57.91,15.75 58.93,15.75 45.47,22.1 46.48,22.1 45.47,13.46 46.48,13.46 72.9,10.16 73.91,10.16 73.91,9.14 72.9,9.14 73.91,8.13 72.9,8.13 74.42,25.91 75.44,25.91 75.44,24.89 74.42,24.89 75.44,23.88 74.42,23.88 60.45,11.18 60.45,12.19 61.47,12.19 61.47,11.18 60.45,23.88 60.45,22.86 61.47,22.86 61.47,23.88 54.36,28.83 56.77,28.83 61.47,28.83 27.56,7.87 27.56,6.6 27.56,9.14 28.83,6.6 28.83,9.14 28.83,7.87 26.29,6.6 25.02,6.6 23.75,6.6 3.19,63.44 12.04,63.44 22.78,58
  pour Bottom (isolate 0.191, rank 2): 0,0 100.08,0 100.08,65.53 0,65.53
  pour Top: 76.71,50.04 99.82,50.04 99.82,32.77 76.2,32.77 72.64,36.32 64.01,36.32 58.67,41.66 53.59,41.66 53.34,41.91 53.34,44.96 65.79,44.96 66.55,45.72 76.71,45.72
  pour Top (no thermals): 45.21,20.45 46.74,20.45 46.74,23.75 45.21,23.75
  pour Top (no thermals): 45.21,11.81 46.74,11.81 46.74,15.11 45.21,15.11
  pour Top (no thermals): 71.12,10.41 74.17,10.41 74.17,7.87 71.12,7.87
  pour Top (no thermals): 72.64,26.16 75.69,26.16 75.69,23.62 72.64,23.62
  pour Top (no thermals): 60.07,12.57 63.75,12.57 63.75,10.79 60.07,10.79
  pour Top (no thermals): 63.75,22.48 60.07,22.48 60.07,24.26 63.75,24.26
  pour Top (no thermals): 23.11,9.78 23.11,5.97 29.46,5.97 29.46,9.78
LINK  (via drill 0.6)
  Top 0.203: U2.28 50.78,53.07 52.07,54.36 R11.2
  Top 0.406: v53.43,55.54 R11.2
  Bottom 0.406: JP1.9 77.85,50.16 73.66,54.36 54.61,54.36 v53.43,55.54
MISO  (via drill 0.3, 0.4)
  Top 0.203: U1.65 24.81,24.98 v25.15,24.64
  Top 0.406: JP6.4 16.76,18.29 17.78,18.29 v18.29,18.8
  Bottom 0.406: v25.15,24.64 14.48,24.64 13.97,24.13 13.97,20.83 14.35,20.45 U4.2 17.78,20.45 18.29,19.94 v18.29,18.8
MOSI  (via drill 0.3)
  Top 0.203: U1.64 24.31,23.8 v24.13,23.62
  Top 0.406: JP6.5 19.3,18.29 v19.3,21.72
  Bottom 0.406: v24.13,23.62 24.13,23.37 23.75,22.99 U4.5 20.57,22.99 v19.3,21.72
N$1
  Top 0.203: U2.24 54.03,50.98 55.12,52.07 R1.1
N$2
  Top 0.203: U2.20 57.39,45.96 57.9,46.47 R2.1
N$3
  Top 0.406: JP1.12 76.2,37.59 76.2,38.1 75.53,38.77 R9.2
N$4
  Top 0.203: U2.29 50.28,53.1 49.02,54.36 R14.2
N$5
  Top 0.406: JP1.10 76.58,44.32 75.95,44.96 75.95,46.74 75.27,47.41 R8.2
N$6
  Top 0.406: SPEED.1 63.59,60.58 R7.1
N$7  (via drill 0.3)
  Top 0.406: Q2.3 62.43,63.84 SPEED.2 62.37,61.64 v61.72,61.64
  Bottom 0.406: Q1.3 v61.72,61.64
N$8  (via drill 0.3)
  Top 0.406: R10.1 55.2,61.64 56.64,61.64 | 56.64,61.64 Q2.1 | v56.64,63.5 56.64,61.64
  Bottom 0.406: Q1.1 56.98,63.84 v56.64,63.5
N$9
  Top 0.203: U2.1 46.78,38.14 44.49,35.86 U1.85
N$10
  Top 0.203: C62.2 41.15,58.61 41.15,57.66 43.94,54.86 43.94,52.58 44.7,51.82 47.24,51.82 47.78,51.28 U2.34
  Top 0.406: Y1.1 41.56,59.38 C62.2
N$11
  Top 0.203: U1.84 44.76,35.36 47.28,37.88 U2.2
N$12  (via drill 0.3)
  Top 0.203: U2.41 42.15,45.96 v41.78,45.59 | U1.87 39.65,36.86 40.39,37.59 v40.39,39.75
  Bottom 0.203: v41.78,45.59 41.53,45.59 40.13,44.2 40.13,41.53 40.39,41.27 v40.39,39.75
N$13  (via drill 0.3)
  Top 0.203: U2.39 40.23,46.96 39.75,46.48 v39.75,45.59 | U1.88 38.37,37.36 38.86,37.85 v38.86,39.75
  Bottom 0.203: v38.86,39.75 38.86,41.78 39.12,42.04 39.12,44.96 v39.75,45.59
N$14  (via drill 0.3)
  Top 0.203: U2.38 39.97,47.46 v38.73,46.23 | v37.34,39.75 36.95,39.36 U1.92
  Bottom 0.203: v37.34,39.75 37.34,41.02 38.61,42.29 38.61,46.1 v38.73,46.23
N$15  (via drill 0.3)
  Top 0.203: U1.94 32.99,40.36 v33.27,40.64 | U2.25 52.28,48.47 v51.82,48.01
  Bottom 0.203: v51.82,48.01 39.37,48.01 37.97,46.61 37.97,42.29 36.32,40.64 v33.27,40.64
N$16  (via drill 0.3)
  Top 0.203: U1.95 32.35,40.86 33.66,42.16 33.78,42.29 42.29,42.29 v42.42,42.16 | U2.31 v49.28,46.99
  Bottom 0.203: v42.42,42.16 44.45,42.16 v49.28,46.99
N$17  (via drill 0.3)
  Top 0.203: U2.30 49.78,51.06 v49.53,51.31 | U1.105 32.4,45.86 v35.56,49.02 36.2,49.66 R36.2
  Bottom 0.203: v35.56,49.02 37.85,51.31 v49.53,51.31
N$18
  Top 0.203: U1.123 21.31,54.83 OSC1.3
N$22
  pour Top (no thermals): 59.97,15.42 59.97,16.18 69.34,16.18 69.34,15.11 72.14,15.11 72.9,15.88 72.9,17.53 75.18,17.53 75.18,15.49 73.41,13.72 64.26,13.72 64.26,15.42
N$23
  Top 0.203: R17.2 50.55,29.72 50.97,30.14 C28.2
N$24
  Top 0.203: U3.15 55.15,10.28 54.77,9.91 52.83,9.91 52.58,9.65 R18.1
N$25
  Top 0.203: U3.22 58.65,10.28 59.02,9.91 60.96,9.91 61.21,9.65 R16.2
N$26
  Top 0.203: U3.39 58.65,24.26 59.02,24.64 64.01,24.64 65.28,25.91 R15.1
N$27
  Top 0.203: R17.1 50.55,25.91 51.82,24.64 54.77,24.64 55.15,24.26 U3.46
N$28
  Top 0.203: R15.2 65.28,29.72 64.86,30.14 C26.2
N$29
  pour Top (no thermals): 59.97,19.63 59.97,18.87 69.34,18.87 69.34,19.94 72.14,19.94 72.9,19.18 72.9,18.03 75.18,18.03 75.18,20.07 73.66,21.59 64.26,21.59 64.26,19.63
N$30
  Top 0.203: C29.1 R18.2
N$31
  Top 0.203: C27.1 R16.1
N$32  (via drill 0.3)
  Top 0.203: U3.44 56.15,24.73 55.63,25.25 C30.2 | U3.47 54.65,22.84 v54.23,23.25 | U3.38 59.15,22.32 v59.43,22.61 | v54.61,25.91 54.61,26.67 55.03,27.09 C30.2 | v56.64,25.91 56.64,26.67 56.22,27.09 C30.2
  Bottom 0.203: v59.43,22.61 59.43,23.12 v56.64,25.91 | v54.23,23.25 54.23,25.53 v54.61,25.91
N$33
  Top 0.203: U3.42 57.15,24.94 57.91,25.71 C31.2
N$34
  Top 0.203: U3.32 70.43,18.53 C25.1
N$35
  Top 0.203: U3.28 70.43,16.53 C32.1
N$36
  Top 0.203: U3.40 58.15,24.47 58.82,25.15 61.98,25.15 62.74,25.91 R20.2 63.67,27.09 64.01,27.43 64.01,27.69 64.26,27.94 66.29,27.94 66.55,28.19 66.55,28.45 66.89,28.79 R21.2
N$37
  Top 0.203: U3.1 49.11,20.53 48.77,20.87 C34.1
N$38
  Top 0.203: U3.3 48.03,19.53 47.5,20.07 44.7,20.07 44.45,20.32 | C34.2 48.77,23.88 48.51,24.13 44.96,24.13 44.7,23.88 44.7,20.57 44.45,20.32 | L3.2 44.22,20.09 44.45,20.32
  pour Top (no thermals): 39.88,21.34 44.7,21.34 44.7,19.3 39.88,19.3
N$39
  Top 0.203: U3.12 49.11,15.03 48.77,14.69 C33.1
N$40
  Top 0.203: U3.10 48.03,16.03 47.5,15.49 44.7,15.49 44.45,15.24 | C33.2 48.77,11.68 48.51,11.43 44.96,11.43 44.7,11.68 44.7,14.99 | 44.7,14.99 | L4.2 44.22,15.47 44.45,15.24 | 44.45,15.24 44.7,14.99
  pour Top (no thermals): 39.88,16.26 44.7,16.26 44.7,14.22 39.88,14.22
N$41
  Top 0.203: U3.41 57.65,24.73 58.57,25.65 59.94,25.65 60.2,25.91 R19.1
N$42
  Top 2.184: JP3.3 7.41,2.57 JP3.2 22.46,2.57 Q4.5
  pour Top (no thermals): 21.34,3.58 26.67,3.58 26.67,1.55 21.34,1.55
N$43
  Top 0.203: U1.60 22.31,23.92 24.8,21.42 R28.2
N$45  (via drill 0.3)
  Top 0.203: U3.29 71.89,17.03 v72.14,17.27
  Top 0.61: v77.72,17.78 78.36,17.14 Q3.2
  Bottom 0.61: v72.14,17.27 72.64,17.78 v77.72,17.78
N$46  (via drill 0.3)
  Top 0.203: U3.31 71.88,18.03 72.14,18.29 v72.14,18.8
  Top 0.61: v77.72,19.05 78.36,19.68 Q3.4
  Bottom 0.61: v77.72,19.05 72.39,19.05 v72.14,18.8
N$47
  Top 0.203: U3.21 58.15,9.93 58.42,9.65 R22.1 59.35,8.47 60.2,7.62 62.23,7.62 63.08,6.77 R23.1
N$48
  Top 0.203: U3.45 55.65,24.5 54.99,25.15 53.85,25.15 53.09,25.91 R24.2 52.16,27.09 51.82,27.43 51.82,27.69 51.56,27.94 49.53,27.94 49.28,28.19 49.28,28.45 48.93,28.79 R25.2
N$49
  Top 0.203: U3.16 55.65,9.93 55.37,9.65 R26.1 54.44,8.47 53.59,7.62 51.56,7.62 50.71,6.77 R27.1
N$51
  Top 0.203: R29.2 30.23,22.35 29.72,22.86 27.94,22.86 26.81,23.99 U1.69
N$52
  Top 0.203: U1.39 11.81,25.52 11.18,24.89 R31.1
N$56
  Top 0.203: C63.2 46.99,58.35 46.99,57.4 44.45,54.86 44.45,52.83 44.96,52.32 47.5,52.32 48.28,51.54 U2.33
  Top 0.406: Y1.3 C63.2 | C63.2
N$57
  Top 0.254: Q4.4 22.23,8.59
  Top 0.813: R34.2 20.32,7.37 21.54,8.59 22.23,8.59
N$60
  Top 0.254: U5.11 3.56,55.88 4.06,56.39 5.84,56.39 8.24,58.79 JP4.2
N$61
  Top 0.254: U5.12 2.91,56.25 3.81,57.15 5.59,57.15 7,58.56 JP4.3
N$62
  Top 0.254: U5.13 2.26,56.61 3.56,57.91 5.33,57.91 5.75,58.32 JP4.4
N$63
  Top 0.203: U5.2 2.26,48.04 2.54,47.75 2.54,40.89 3.58,39.86 U1.16
N$64
  Top 0.203: U5.3 2.91,48.15 3.05,48.01 3.05,41.15 3.84,40.36 U1.15
N$65
  Top 0.203: U5.4 3.56,41.4 4.1,40.86 U1.14
N$68  (via drill 0.3)
  Top 0.203: U2.40 41,46.46 v40.77,46.23 | v39.62,41.02 36.2,41.02 35.03,39.86 U1.93
  Bottom 0.178: 40.77,45.47 39.62,44.32
  Bottom 0.203: v40.77,46.23 40.77,45.47 | 39.62,44.32 v39.62,41.02
N$70  (via drill 0.3)
  Top 0.203: U2.42 42.67,45.46 42.04,44.83 37.59,44.83 v37.21,45.21 | v32.38,42.04 32.21,41.86 U1.97
  Bottom 0.203: v32.38,42.04 35.56,45.21 v37.21,45.21
N$71
  Top 0.178: 65.79,47.24 68.33,49.78 R35.1
  Top 0.203: U2.21 57.13,46.46 57.91,47.24 65.79,47.24
PFO  (via drill 0.3, 0.6)
  Top 0.203: U2.18 57.92,44.96 58.42,45.47 v59.44,45.47 | C11.1 58.33,50.46 55.34,47.46 U2.23 52.8,47.46 52.07,46.74 51.05,46.74 50.04,45.72 48.51,45.72 47.75,46.48 47.75,47.5 47.29,47.96 U2.37 44.7,48.19 44.7,48.64
  Top 0.61: 44.9,48.17 44.9,48.44 44.7,48.64 44.32,49.02 C10.1 | v60.96,49.02 C11.1 62.83,50.46 62.98,50.31 C12.1
  Bottom 0.203: v59.44,45.47 C9.1
  Bottom 0.61: C9.1 61.13,48.86 v60.96,49.02
RX+
  Top 0.178: 75.48,36.94 75.52,36.9
  Top 0.203: U2.14 59.15,42.96 64.01,38.1 66.8,38.1 67.22,38.52 R3.2 68.92,38.52 69.34,38.1 72.64,38.1 73.89,36.85 arc90 74.64,36.85 74.73,36.94 arc-90 75.48,36.94 | JP1.7 82.68,36.7 80.26,34.29 76.45,34.29 75.44,35.31 arc-90 75.44,36.06 75.52,36.15 arc90 75.52,36.9
RX-
  Top 0.203: U2.13 58.88,42.46 63.75,37.59 66.8,37.59 67.22,37.17 R4.1 68.92,37.17 69.34,37.59 72.39,37.59 76.2,33.78 80.52,33.78 83.69,36.96 JP1.8
RXD0
  Top 0.203: U2.43 42.93,44.96 42.33,44.36 U1.102
RXD1
  Top 0.203: U2.44 43.19,44.46 42.59,43.86 U1.101
RXD2
  Top 0.203: U2.45 43.45,43.96 42.85,43.36 U1.100
RXD3
  Top 0.203: U2.46 43.72,43.46 43.11,42.86 U1.99
SPEED
  Top 0.203: U2.27 51.28,52.8 52.32,53.85 54.61,53.85 55.12,54.36 R12.2
  Top 0.406: R7.2 60.96,57.78 59.56,59.18 56.9,59.18 | 56.9,59.18 56.22,59.86 R10.2 | R12.2 56.3,55.54 56.9,56.13 56.9,59.18
SPI_CLK  (via drill 0.3)
  Top 0.203: U1.70 27.31,25.52 v27.69,25.15
  Top 0.406: JP6.6 22.1,14.99 23.62,14.99 v24.64,16
  Bottom 0.406: U4.6 25.15,21.72 | 25.15,21.72 25.27,21.72 27.69,24.13 v27.69,25.15 | 25.15,21.72 25.15,16.51 v24.64,16
TX+
  Top 0.178: 74.81,44.59 74.82,44.58
  Top 0.203: U2.17 66.81,44.46 67.22,44.87 R5.2 68.92,44.87 69.34,44.45 72.64,44.45 72.9,44.19 arc90 73.66,44.19 74.06,44.59 arc-90 74.81,44.59 | JP1.1 81.53,44.7 80.77,44.7 78.49,42.42 74.68,42.42 74.42,42.67 arc-90 74.42,43.43 74.82,43.83 arc90 74.82,44.58
TX-
  Top 0.203: U2.16 66.78,43.96 67.22,43.52 R6.1 68.92,43.52 69.34,43.94 72.39,43.94 74.42,41.91 78.74,41.91 81.03,44.2 81.79,44.2 82.17,44.58 JP1.2
TXD0
  Top 0.203: U2.3 47.78,37.62 45.02,34.86 U1.83
TXD1
  Top 0.203: U2.4 48.28,37.36 45.28,34.36 U1.82
TXD2
  Top 0.203: U2.5 48.78,37.1 45.54,33.86 U1.81
TXD3
  Top 0.203: U2.6 49.28,36.83 45.8,33.36 U1.80

### Text on the board
tPlace: OSHW
tDocu: Green - / 100Mb/s / Red - / 10Mb/s | GND | OPL Sniffer / OPL2 to Ethernet board / by Rachel Mant